# Altium schematic sheet POWER.SchDoc: Gimbal - Power
size Letter; Author: Aidan Gratton; DrawnBy: Aidan Gratton; Organization: UW Robotics; Address1: 200 University Avenue; Address2: Waterloo; Address3: Ontario; Address4: Canada N2L 3G6; SheetNumber: 6; SheetTotal: 7
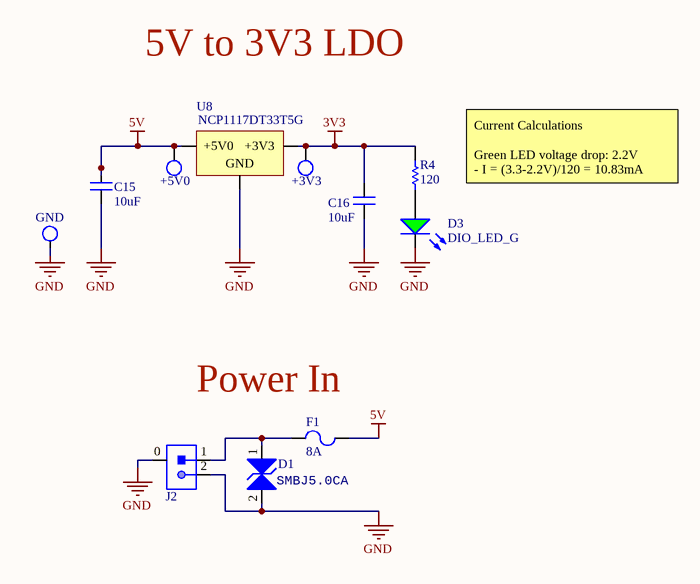
[diagram p0: POWER.SchDoc]

## Parts
+3V3  TESTPOINT_LOOP  [TESTPOINT_LOOP]  (value not drawn)
+5V0  TESTPOINT_LOOP  [TESTPOINT_LOOP]  (value not drawn)
C15  10uF  [CAPC1206(3216)]
C16  10uF  [CAPC1206(3216)]
D1  Manufacturer Part Number 1: SMBJ5.0CA  [TVS_DIODE_BIDIRECTIONAL]  (hidden comment: TVS_DIODE_BIDIRECTIONAL)
D3  DIO_LED_G  [LED_0805_LINE]
F1  Current Rating: 8A  [FUSE_1206]  (hidden comment: FUSE_8A_1206)
GND  TESTPOINT_LOOP  [TESTPOINT_LOOP]  (value not drawn)
J2  CON_2M_SM_RA  [MOLEX-5024940270]  (value not drawn)
R4  value 120  [RESC0603(1608)_N]  (hidden comment: RES_120R_0603)
U8  MPN: NCP1117DT33T5G  [VOLTAGE_REGULATOR]  (hidden comment: 5V0_3V3_LDO)

## Nets
3V3: +3V3.1 C16.2 R4.2 U8.2(+3V3)
5V: +5V0.1 C15.2 F1.2 U8.3(+5V0)
GND: C15.1 C16.1 D1.2 D3.2(K) GND.1 J2.0 J2.2 U8.1(GND)
NetD1_1: D1.1 F1.1 J2.1
NetD3_1: D3.1(A) R4.1

## Notes on the sheet
- 5V to 3V3 LDO
- Current Calculations
  Green LED voltage drop: 2.2V
  - I = (3.3-2.2V)/120 = 10.83mA
- Power In
- Title
- Size:
- Date:
- Letter
- Drawn By:
- Sheet
- of
- File:

## Library data of the parts
+3V3 +5V0 GND = TESTPOINT_LOOP: Loop testpoint through-hole pad; Manufacturer: Keystone Electronics; Manufacturer Part Number 1: 5002; Supplier Part Number 1: 36-5002-ND; Supplier 1: Digi-Key
C15 C16 = CAP_10uF_50V_1206: CAP CER 10UF 50V X5R 1206; MPN: GRT31CR61H106KE01L; Manufacturer: Murata; Dimensions: 0.126" L x 0.063" W (3.20mm x 1.6mm); Package: 1206 (3216 Metric); Supplier Part Number 1: 490-12456-1-ND; Supplier 1: Digi-Key; Value: 10uF; Voltage Rating: 50V
D1 = TVS_DIODE_BIDIRECTIONAL: TVS DIODE 5V 9.2V DO214AA; Manufacturer: Nexperia USA Inc.; Manufacturer 1: Littelfuse; Max Surge Current: 65.3A; Reverse Breakdown Voltage: 6.4V; Number of Elements: 1; Peak Pulse Power: 600W; Power Line Protection: No; Max Breakdown Voltage: 7V; Test Current: 10mA; ESD Protection: Yes; Max Reverse Leakage Current: 1.6mA; Max Power Dissipation: 5W; Element Configuration: Single; Package: SC-70, SOT-323; ComponentLink1Description: Datasheet; ComponentLink1URL: https://www.littelfuse.com/~/media/electronics/datasheets/tvs_diodes/littelfuse_tvs_diode_smbj_datasheet.pdf.pdf; Supplier Part Number 1: SMBJ5.0CALFCT-ND; Supplier 1: Digi-Key; Stock 1: 23233; Pricing 1: 1=0.39000, 10=0.31300, 25=0.28640, 100=0.17980, 250=0.17784, 500=0.16650, 1000=0.11322 (USD); Mount: Surface Mount; Case/Package: SMB; Number of Pins: 2; Min Operating Temperature: -65°C; Max Operating Temperature: 150°C; Direction: Bidirectional; Package Quantity: 3000; Packaging: Tape and Reel; Operating Supply Voltage: 5V; Number of Bidirectional Channels: 1; Reverse Standoff Voltage: 5V; Min Breakdown Voltage: 6.4V; Clamping Voltage: 9.2V; Breakdown Voltage: 6.4V; Number of Channels: 1; Polarity: Bidirectional; Power Dissipation: 600W; Peak Pulse Current: 65.3A; Leakage Current: 1.6mA; Voltage Rating (DC): 5V; Composition: Zener; Length: 0.179inch; Height: 0.096inch; Width: 0.155inch; Radiation Hardening: No; REACH SVHC: No SVHC; Lead Free: Lead Free
D3 = DIO_LED_G: LED GREEN DIFFUSED 0805 SMD; MPN: LG R971-KN-1; Manufacturer: OSRAM; Forward Voltage Drop: 2.2V; Package: 0805 (2012 Metric); Supplier Part Number 1: 475-1410-1-ND; Supplier 1: Digi-Key
F1 = FUSE_8A_1206: FUSE SMD 8A 24V; Manufacturer 1: Littelfuse; Manufacturer Part Number 1: 0469008.WR; Fuse Type: Board Mount (Cartridge Style Excluded); DC Cold Resistance: 31mR; Power Dissipation: 157.5mW; Approvals: UL,CSA; Supplier 1: Digi-Key; Stock 1: 8989; Pricing 1: 1=0.84000, 5=0.81200, 10=0.78700, 50=0.66180, 100=0.54930, 250=0.49940, 500=0.42450, 1000=0.37455 (USD); RoHS: Yes; Mount: Surface Mount; Case/Package: 1206; Case Code (Imperial): 1206; Case Code (Metric): 3216; Housing Material: Ceramic; Min Operating Temperature: -55°C; Max Operating Temperature: 90°C; Package Quantity: 5000; Voltage Rating (AC): 24V; Voltage Rating (DC): 24V; Packaging: Tape and Reel; Current: 8A; Length: 3.18mm; Height: 0.023inch; Width: 0.06inch; Depth: 1.52mm; ComponentLink1URL: https://datasheet.ciiva.com/7444/littelfuse-fuse-466-7444359.pdf?src-supplier=Digi-Key; ComponentLink1Description: https://datasheet.ciiva.com/7444/littelfuse-fuse-466-7444359.pdf?src-supplier=Digi-Key; ComponentLink2URL: https://datasheet.ciiva.com/7444/littelfuse-fuse-466-7444363.pdf?src-supplier=Digi-Key; ComponentLink2Description: https://datasheet.ciiva.com/7444/littelfuse-fuse-466-7444363.pdf?src-supplier=Digi-Key; ComponentLink3URL: https://datasheet.ciiva.com/7444/littelfuse-fuse-466-7444350.pdf?src-supplier=Digi-Key; ComponentLink3Description: https://datasheet.ciiva.com/7444/littelfuse-fuse-466-7444350.pdf?src-supplier=Digi-Key; Supplier Part Number 1: F3542CT-ND
J2 = CON_2M_SM_RA: CONN HEADER SMD RIGHT ANGLE 2MM PITCH; Manufacturer 1: Molex; Manufacturer Part Number 1: 5024940270; Connector Type: Receptacle,Forked; Number of Positions: 2; Supplier 1: Digi-Key; Stock 1: 3397; Pricing 1: 1=0.53000, 10=0.49400, 25=0.44440, 50=0.39500, 100=0.37850, 250=0.34556 (USD); RoHS: No; Mount: Surface Mount; Contact Plating: Tin; Insulation Color: Natural; Insulation Material: Resin; Min Operating Temperature: -40°C; Max Operating Temperature: 105°C; Fastening Type: Latch; Packaging: Tape and Reel; Number of Rows: 1; Termination: Solder; Flammability Rating: UL94 V-0; ComponentLink1URL: https://www.molex.com/pdm_docs/as/AS-502439-002-001.pdf?src-supplier=Digi-Key; ComponentLink1Description: https://www.molex.com/pdm_docs/as/AS-502439-002-001.pdf?src-supplier=Digi-Key; Supplier Part Number 1: WM15810CT-ND
R4 = RES_120R_0603: RES SMD 120 OHM 5% 1/10W 0603; Manufacturer 1: Yageo; Manufacturer Part Number 1: RC0603JR-07120RL; Package: 0603 (1608 Metric); Dimensions: 0.063" L x 0.031" W (1.60mm x 0.80mm); Tolerance: 5%; Supplier Part Number 1: 311-120GRCT-ND; Supplier 1: Digi-Key; Mount: Surface Mount
U8 = 5V0_3V3_LDO: IC REG LINEAR 3.3V 1A DPAK; Manufacturer: ON Semiconductor; Current Output: 1A; Supplier Part Number 1: NCP1117DT33T5GOSCT-ND; Supplier 1: Digi-Key